# EAGLE design ioboard (EAGLE 9.6.2)
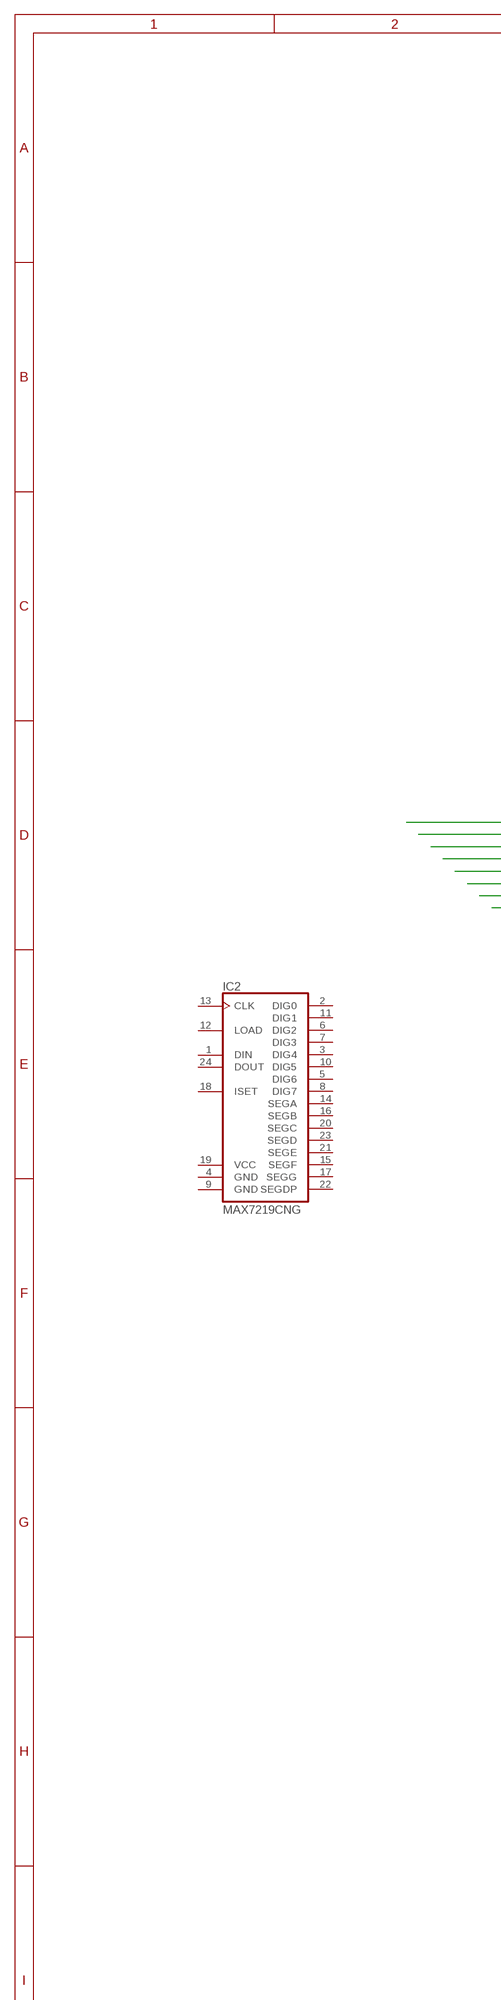
[diagram p0: schematic, sheet 1, part 1 of 2]
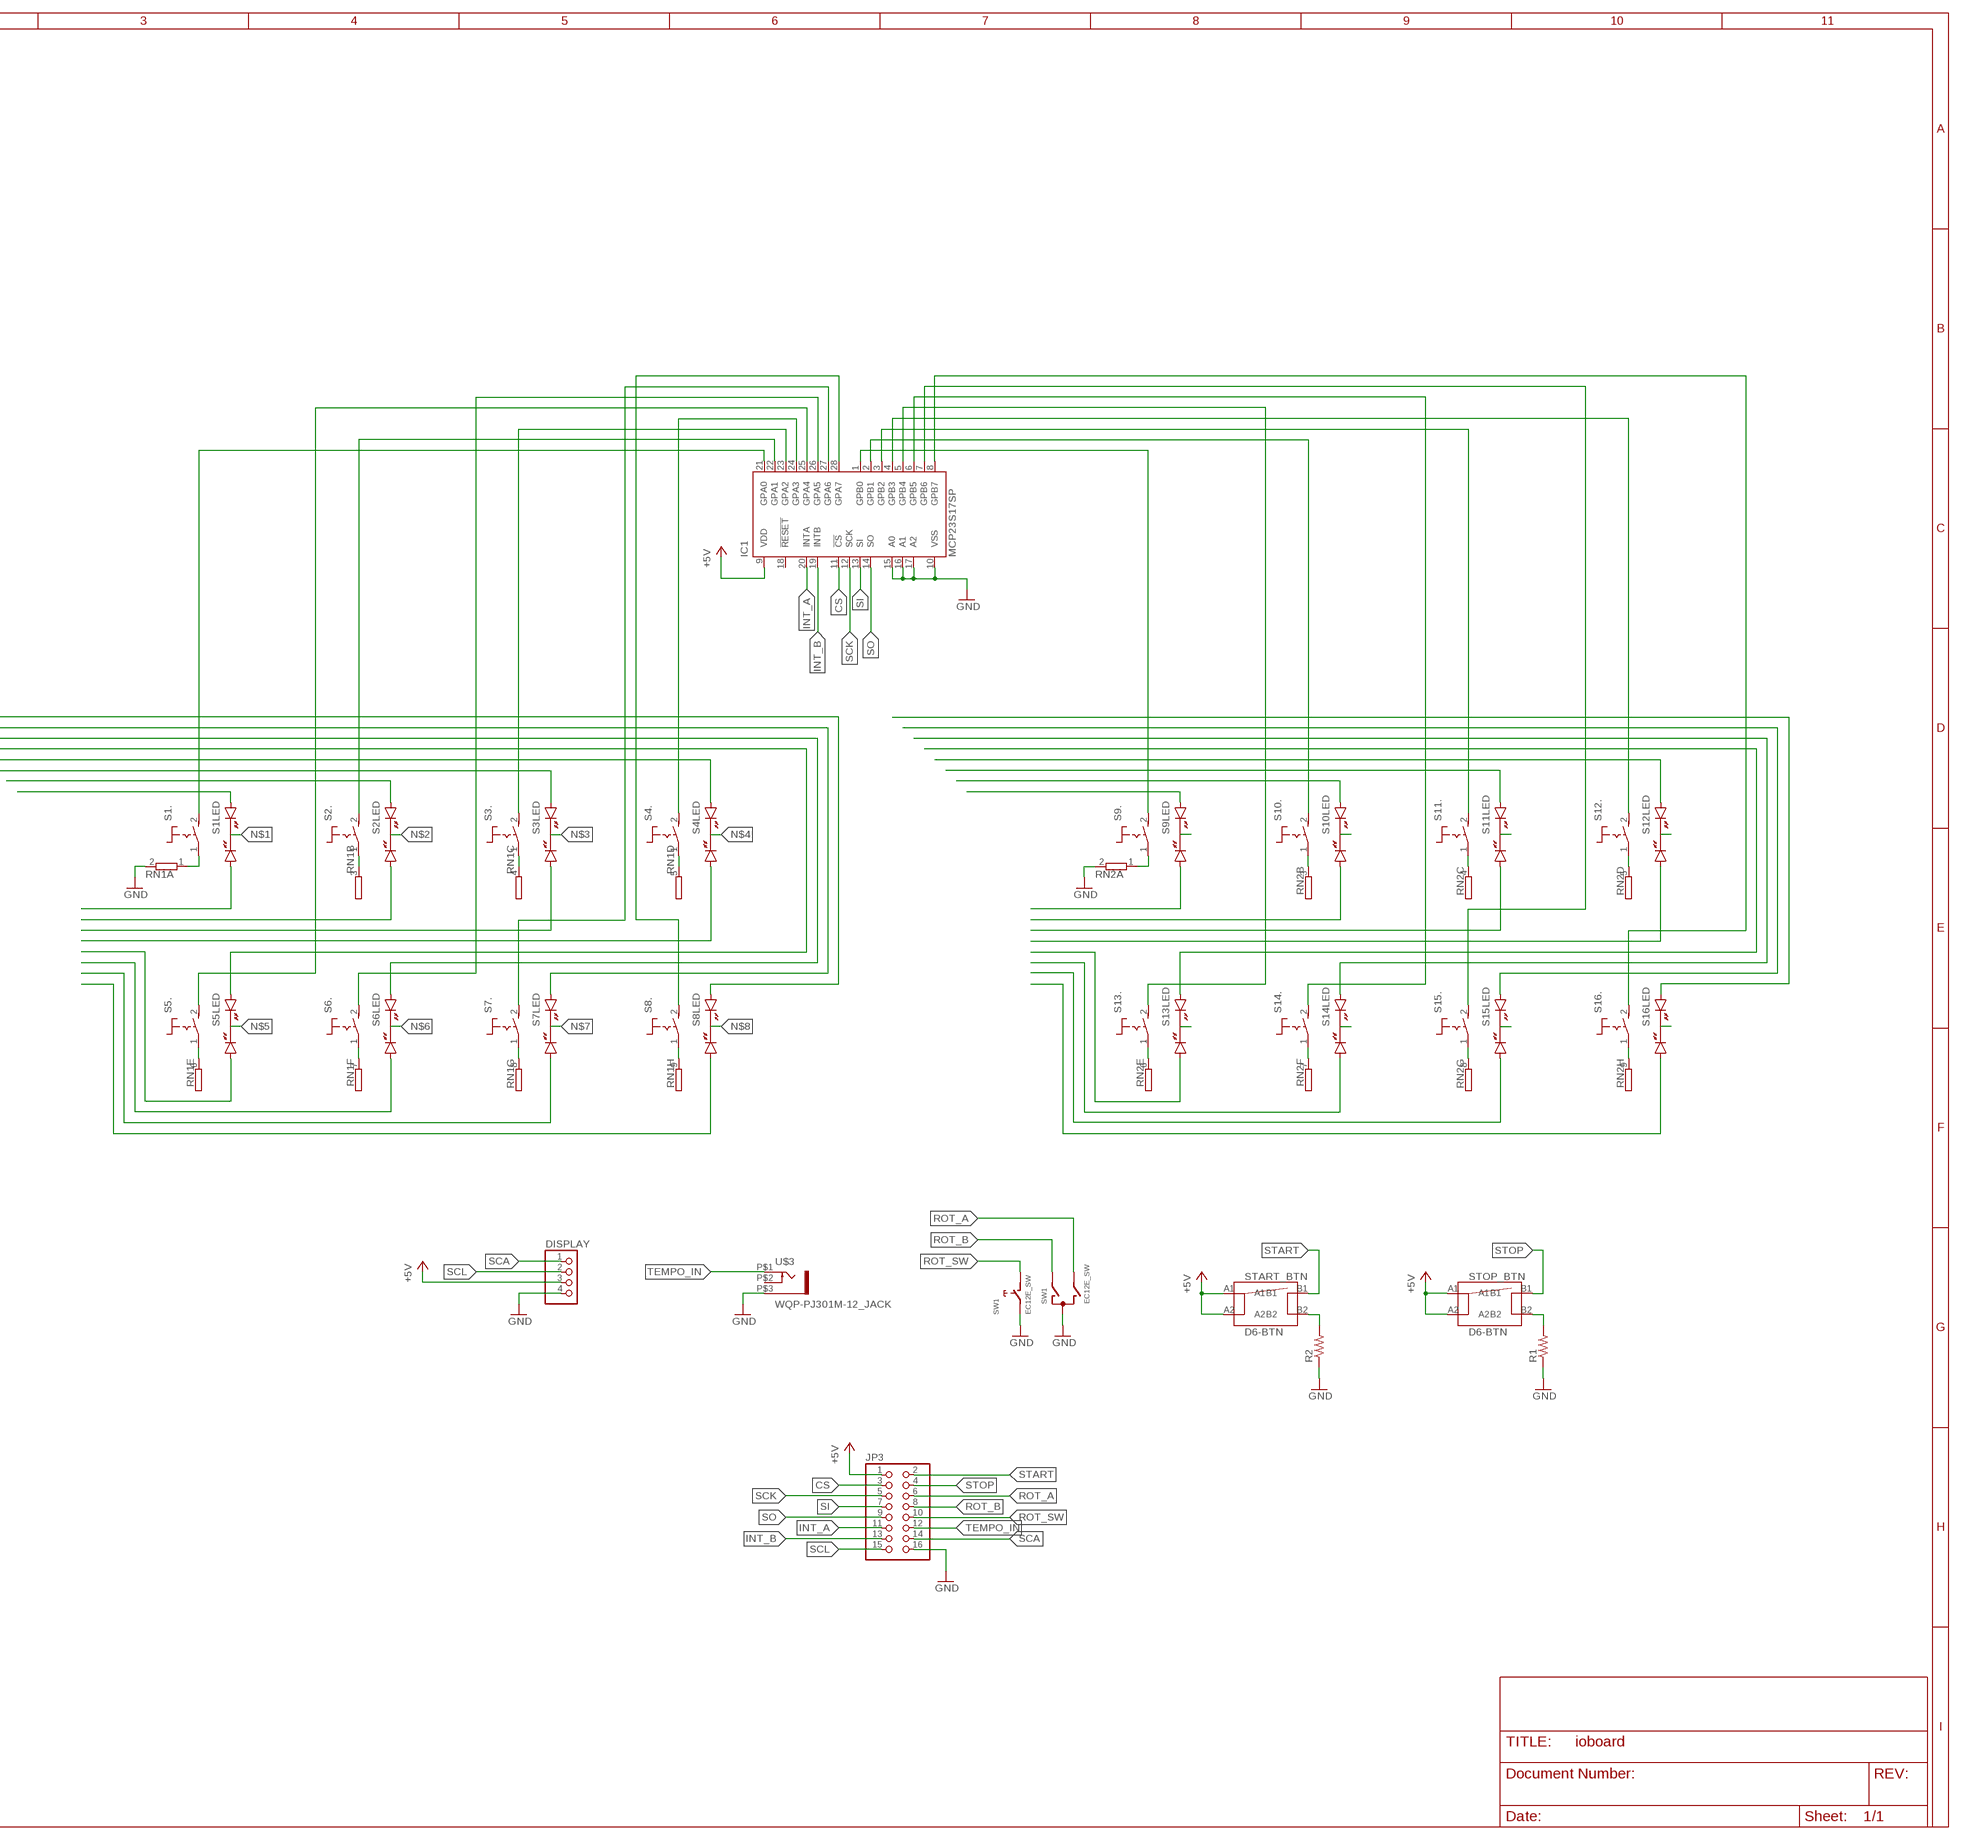
[diagram p1: schematic, sheet 1, part 2 of 2]

## Parts
DISPLAY  PINHD-1X4  [1X04]
IC1  MCP23S17SP  [DIL28-3]
IC2  MAX7219CNG  [DIL24-3]
JP3  PINHD-2X8  [2X08]
R1  R-US_0207/7  [0207/7]
R2  R-US_0207/7  [0207/7]
RN1  GE08R  [SIL9]
RN2  GE08R  [SIL9]
S1  MARQ6425-3MM-DUOLED  [MARQ6425-3MM-DUOLED]
S2  MARQ6425-3MM-DUOLED  [MARQ6425-3MM-DUOLED]
S3  MARQ6425-3MM-DUOLED  [MARQ6425-3MM-DUOLED]
S4  MARQ6425-3MM-DUOLED  [MARQ6425-3MM-DUOLED]
S5  MARQ6425-3MM-DUOLED  [MARQ6425-3MM-DUOLED]
S6  MARQ6425-3MM-DUOLED  [MARQ6425-3MM-DUOLED]
S7  MARQ6425-3MM-DUOLED  [MARQ6425-3MM-DUOLED]
S8  MARQ6425-3MM-DUOLED  [MARQ6425-3MM-DUOLED]
S9  MARQ6425-3MM-DUOLED  [MARQ6425-3MM-DUOLED]
S10  MARQ6425-3MM-DUOLED  [MARQ6425-3MM-DUOLED]
S11  MARQ6425-3MM-DUOLED  [MARQ6425-3MM-DUOLED]
S12  MARQ6425-3MM-DUOLED  [MARQ6425-3MM-DUOLED]
S13  MARQ6425-3MM-DUOLED  [MARQ6425-3MM-DUOLED]
S14  MARQ6425-3MM-DUOLED  [MARQ6425-3MM-DUOLED]
S15  MARQ6425-3MM-DUOLED  [MARQ6425-3MM-DUOLED]
S16  MARQ6425-3MM-DUOLED  [MARQ6425-3MM-DUOLED]
START_BTN  D6-BTN  [D6-BTN]
STOP_BTN  D6-BTN  [D6-BTN]
SW1  EC12E_SW  [ALPS_EC12E_SW]
U$3  WQP-PJ301M-12_JACK  [WQP-PJ301M-12_JACK]

## Nets
+5V: DISPLAY.3 IC1.9(VDD) JP3.1 START_BTN.A1 START_BTN.A2 STOP_BTN.A1 STOP_BTN.A2
CS: IC1.11(!CS) JP3.3
GND: DISPLAY.4 IC1.10(VSS) IC1.15(A0) IC1.16(A1) IC1.17(A2) JP3.16 R1.1 R2.1 RN1.2 RN2.2 SW1.C SW1.E U$3.P$3
INT_A: IC1.20(INTA) JP3.11
INT_B: IC1.19(INTB) JP3.13
N$1: S1.K(LED:K)
N$2: S2.K(LED:K)
N$3: S3.K(LED:K)
N$4: S4.K(LED:K)
N$5: S5.K(LED:K)
N$6: S6.K(LED:K)
N$7: S7.K(LED:K)
N$8: S8.K(LED:K)
N$9: S9.K(LED:K)
N$10: S10.K(LED:K)
N$11: S11.K(LED:K)
N$12: S12.K(LED:K)
N$13: S13.K(LED:K)
N$14: S14.K(LED:K)
N$15: S15.K(LED:K)
N$16: S16.K(LED:K)
N$17: S1.AR(LED:AR)
N$18: S2.AR(LED:AR)
N$19: S3.AR(LED:AR)
N$20: S4.AR(LED:AR)
N$21: S5.AR(LED:AR)
N$22: S6.AR(LED:AR)
N$23: S7.AR(LED:AR)
N$24: S8.AR(LED:AR)
N$25: S1.AG(LED:AG)
N$26: S2.AG(LED:AG)
N$27: S3.AG(LED:AG)
N$28: S4.AG(LED:AG)
N$29: S5.AG(LED:AG)
N$30: S6.AG(LED:AG)
N$31: S7.AG(LED:AG)
N$32: S8.AG(LED:AG)
N$33: S9.AR(LED:AR)
N$34: S10.AR(LED:AR)
N$35: S11.AR(LED:AR)
N$36: S12.AR(LED:AR)
N$37: S13.AR(LED:AR)
N$38: S14.AR(LED:AR)
N$39: S15.AR(LED:AR)
N$40: S16.AR(LED:AR)
N$41: S9.AG(LED:AG)
N$42: S10.AG(LED:AG)
N$43: S11.AG(LED:AG)
N$44: S12.AG(LED:AG)
N$45: S13.AG(LED:AG)
N$46: S14.AG(LED:AG)
N$47: S15.AG(LED:AG)
N$48: S16.AG(LED:AG)
N$49: RN1.9 S8.1(.:P)
N$50: RN1.8 S7.1(.:P)
N$51: RN1.7 S6.1(.:P)
N$52: RN1.6 S5.1(.:P)
N$53: RN1.5 S4.1(.:P)
N$54: RN1.4 S3.1(.:P)
N$55: RN1.3 S2.1(.:P)
N$56: RN1.1 S1.1(.:P)
N$57: RN2.3 S10.1(.:P)
N$58: RN2.4 S11.1(.:P)
N$59: RN2.5 S12.1(.:P)
N$60: RN2.6 S13.1(.:P)
N$61: RN2.7 S14.1(.:P)
N$62: RN2.8 S15.1(.:P)
N$63: RN2.9 S16.1(.:P)
N$64: RN2.1 S9.1(.:P)
N$65: IC1.21(GPA0) S1.2(.:S)
N$66: IC1.22(GPA1) S2.2(.:S)
N$67: IC1.23(GPA2) S3.2(.:S)
N$68: IC1.24(GPA3) S4.2(.:S)
N$69: IC1.25(GPA4) S5.2(.:S)
N$70: IC1.26(GPA5) S6.2(.:S)
N$71: IC1.27(GPA6) S7.2(.:S)
N$72: IC1.28(GPA7) S8.2(.:S)
N$73: IC1.1(GPB0) S9.2(.:S)
N$74: IC1.2(GPB1) S10.2(.:S)
N$75: IC1.3(GPB2) S11.2(.:S)
N$76: IC1.4(GPB3) S12.2(.:S)
N$77: IC1.5(GPB4) S13.2(.:S)
N$78: IC1.6(GPB5) S14.2(.:S)
N$79: IC1.7(GPB6) S15.2(.:S)
N$80: IC1.8(GPB7) S16.2(.:S)
N$93: R2.2 START_BTN.B2
N$94: R1.2 STOP_BTN.B2
ROT_A: JP3.6 SW1.B
ROT_B: JP3.8 SW1.A
ROT_SW: JP3.10 SW1.D
SCA: DISPLAY.1 JP3.14
SCK: IC1.12(SCK) JP3.5
SCL: DISPLAY.2 JP3.15
SI: IC1.13(SI) JP3.7
SO: IC1.14(SO) JP3.9
START: JP3.2 START_BTN.B1
STOP: JP3.4 STOP_BTN.B1
TEMPO_IN: JP3.12 U$3.P$1
Unconnected: IC1.18(!RESET) IC2.1(DIN) IC2.2(DIG0) IC2.3(DIG4) IC2.5(DIG6) IC2.6(DIG2) IC2.7(DIG3) IC2.8(DIG7) IC2.10(DIG5) IC2.11(DIG1) IC2.12(LOAD) IC2.13(CLK) IC2.14(SEGA) IC2.15(SEGF) IC2.16(SEGB) IC2.17(SEGG) IC2.18(ISET) IC2.20(SEGC) IC2.21(SEGE) IC2.22(SEGDP) IC2.23(SEGD) IC2.24(DOUT) SW1.GND1(G) SW1.GND2(G) U$3.P$2

## Power pins joined to a net without a drawn wire
GND: IC2.4(GND) IC2.9(GND)
VCC: IC2.19(VCC)

## Library data of the parts
DISPLAY = pinhead:PINHD-1X4: PIN HEADER
IC1 = microchip:MCP23S17: http://ww1.microchip.com/downloads/en/DeviceDoc/21952a.pdf Source: http://ww1.microchip.com/downloads/en/DeviceDoc/21952a.pdf; MF: MICROCHIP; MPN: MCP23S17-E/SP; OC_FARNELL: 1292238; OC_NEWARK: 31K2951
IC2 = maxim:MAX7219CNG: LED DISPLAY DRIVER; MF: MAXIM; MPN: MAX7219CNG; OC_FARNELL: 1523914; OC_NEWARK: 34C4018
JP3 = pinhead:PINHD-2X8: PIN HEADER
R1 R2 = rcl:R-US_: RESISTOR, American symbol; SPICEPREFIX: R
RN1 RN2 = resistor-sil:GE08R: SIL RESISTOR; OC_FARNELL: unknown; OC_NEWARK: unknown
S1-S16 = gerbster:MARQ6425-3MM-DUOLED: DIL SWITCH with LED, Marquardt
START_BTN STOP_BTN = gerbster:D6-BTN
SW1 = switch-alps:EC12E_SW: ALPS rotary Encoder EC12E series with switch; MPN: EC12E2424407; OC_FARNELL: 1520813; OC_NEWARK: 74M1068
U$3 = thonkiconn:WQP-PJ301M-12_JACK

## Board
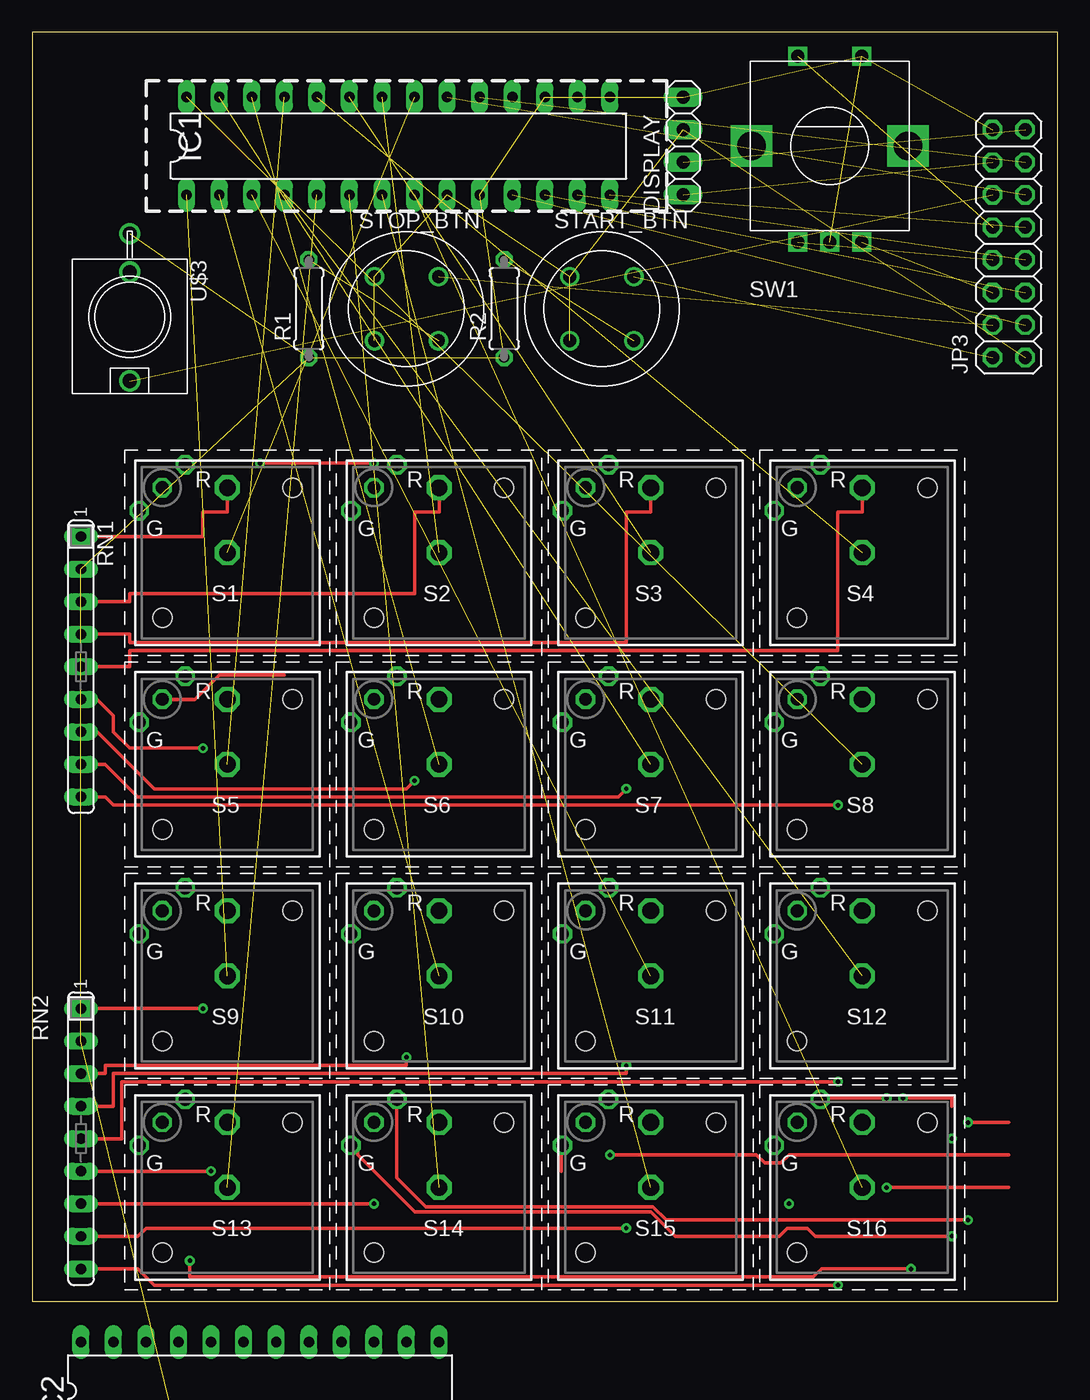
[diagram p2: board, top side]
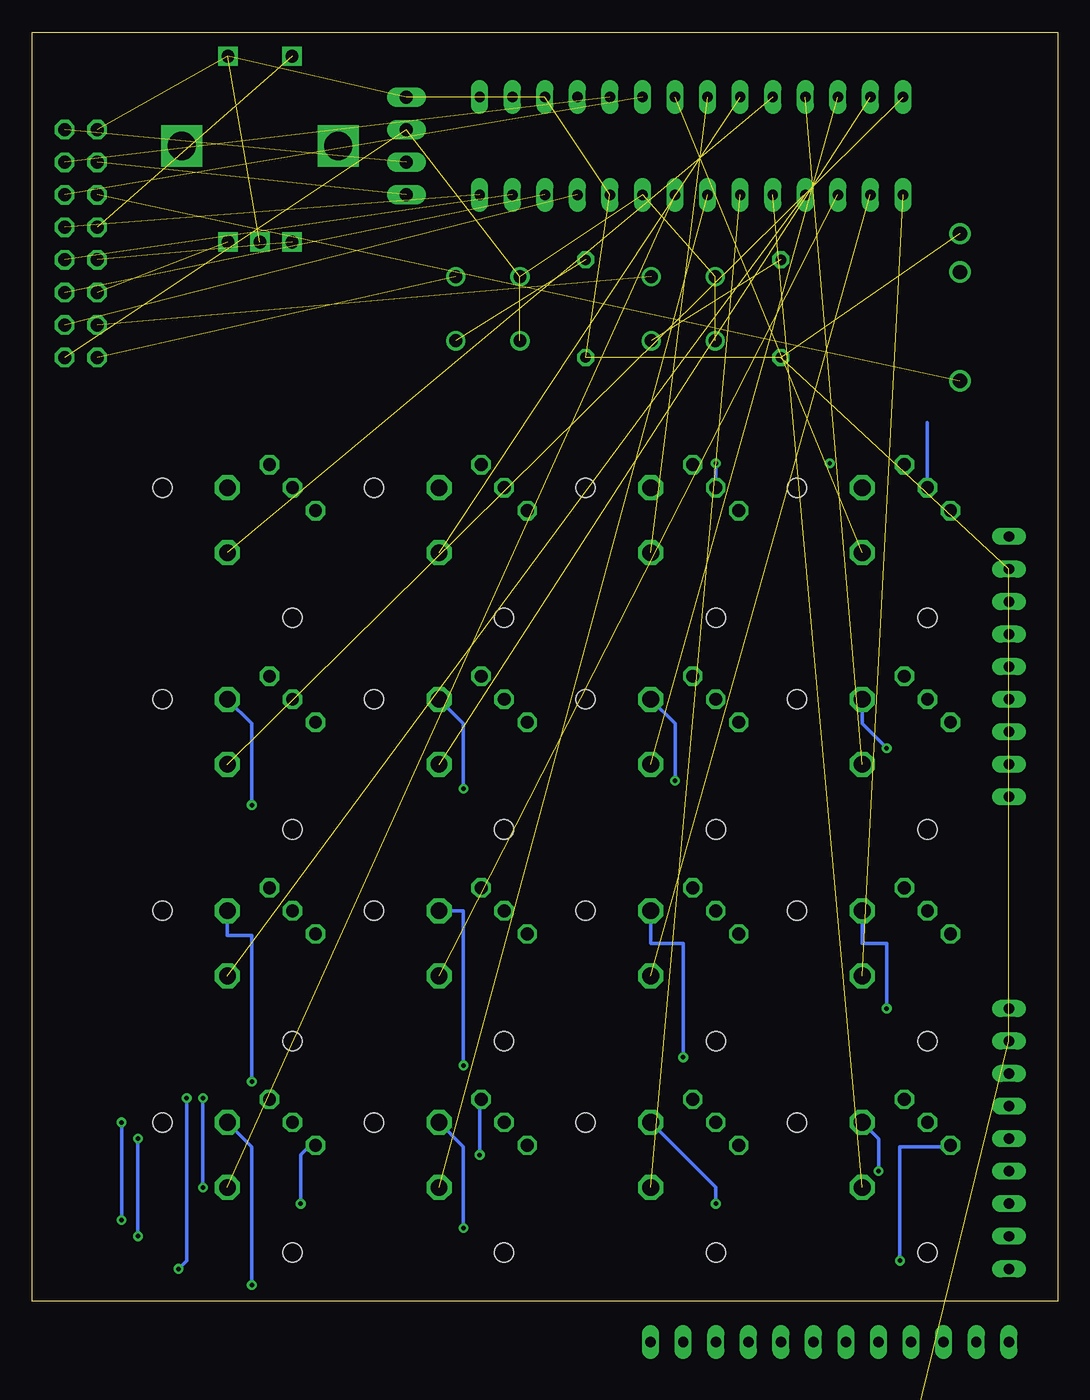
[diagram p3: board, bottom side, seen from below]

Size 80.01 x 99.06 mm. Coordinates in mm from the lower left corner, seen from the top.
Outline: 0,0 80.01,0 80.01,99.06 0,99.06 0,0
Copper layers (1*16): Top 0.035mm / dielectric 1.5mm / Bottom 0.035mm
Design rules "default": minimum track width 6mil, minimum drill 0.35mm, track to track 6mil, track to pad 6mil, pad to pad 6mil, via to via 6mil, smd to smd 6mil, copper to edge 40mil, drill to drill 6mil, minimum pad ring 10mil, minimum via ring 8mil, stop-mask expansion 4mil, vias tented up to drill 0mil, thermal gap 10mil

### Footprints (pad centres in the part's own frame; a part is rotated, then mirrored left to right if it is on the bottom)
1X04 = drill 1.016 long: 1 -3.81,0; 2 -1.27,0; 3 1.27,0; 4 3.81,0
DIL28-3 = drill 0.813 long: 1 -16.51,-3.81; 2 -13.97,-3.81; 3 -11.43,-3.81; 4 -8.89,-3.81; 5 -6.35,-3.81; 6 -3.81,-3.81; 7 -1.27,-3.81; 8 1.27,-3.81; 9 3.81,-3.81; 10 6.35,-3.81; 11 8.89,-3.81; 12 11.43,-3.81; 13 13.97,-3.81; 14 16.51,-3.81; 15 16.51,3.81; 16 13.97,3.81; 17 11.43,3.81; 18 8.89,3.81; 19 6.35,3.81; 20 3.81,3.81; 21 1.27,3.81; 22 -1.27,3.81; 23 -3.81,3.81; 24 -6.35,3.81; 25 -8.89,3.81; 26 -11.43,3.81; 27 -13.97,3.81; 28 -16.51,3.81
DIL24-3 = drill 0.813 long: 1 -13.97,-3.81; 2 -11.43,-3.81; 3 -8.89,-3.81; 4 -6.35,-3.81; 5 -3.81,-3.81; 6 -1.27,-3.81; 7 1.27,-3.81; 8 3.81,-3.81; 9 6.35,-3.81; 10 8.89,-3.81; 11 11.43,-3.81; 12 13.97,-3.81; 13 13.97,3.81; 14 11.43,3.81; 15 8.89,3.81; 16 6.35,3.81; 17 3.81,3.81; 18 1.27,3.81; 19 -1.27,3.81; 20 -3.81,3.81; 21 -6.35,3.81; 22 -8.89,3.81; 23 -11.43,3.81; 24 -13.97,3.81
2X08 = drill 1.016 octagon: 1 -8.89,-1.27; 2 -8.89,1.27; 3 -6.35,-1.27; 4 -6.35,1.27; 5 -3.81,-1.27; 6 -3.81,1.27; 7 -1.27,-1.27; 8 -1.27,1.27; 9 1.27,-1.27; 10 1.27,1.27; 11 3.81,-1.27; 12 3.81,1.27; 13 6.35,-1.27; 14 6.35,1.27; 15 8.89,-1.27; 16 8.89,1.27
0207/7 = drill 0.813 octagon: 1 -3.81,0; 2 3.81,0
SIL9 = drill 0.813 long: 1 -10.16,0; 2 -7.62,0; 3 -5.08,0; 4 -2.54,0; 5 0,0; 6 2.54,0; 7 5.08,0; 8 7.62,0; 9 10.16,0
MARQ6425-3MM-DUOLED = drill 1.3 octagon: 1 0,5.08; 2 0,0 | drill 1 octagon: AG -6.876,3.284; AR -3.284,6.876; K -5.08,5.08 | hole 1.5: 5.08,5.08; -5.08,-5.08
D6-BTN = drill 1: A1 -2.5,2.5; A2 -2.5,-2.5; B1 2.5,2.5; B2 2.5,-2.5
ALPS_EC12E_SW = drill 1 square: A -2.5,-7.5; B 2.5,-7.5; C 0,-7.5; D -2.5,7; E 2.5,7 | drill 2.2 square: GND1 -6.1,0; GND2 6.1,0
WQP-PJ301M-12_JACK = drill 1.1: P$1 0,5; P$2 0,-3.5; P$3 0,-6.5

### Placement (x,y rotation side)
DISPLAY  50.8,90.17 90 top
IC1  28.57,90.17 0 top
IC2  17.78,-6.99 0 top  (outside the outline)
JP3  76.2,82.55 90 top
R1  21.59,77.47 90 top
R2  36.83,77.47 90 top
RN1  3.81,49.53 270 top
RN2  3.81,12.7 270 top
S1  15.24,58.42 0 top
S2  31.75,58.42 0 top
S3  48.26,58.42 0 top
S4  64.77,58.42 0 top
S5  15.24,41.91 0 top
S6  31.75,41.91 0 top
S7  48.26,41.91 0 top
S8  64.77,41.91 0 top
S9  15.24,25.4 0 top
S10  31.75,25.4 0 top
S11  48.26,25.4 0 top
S12  64.77,25.4 0 top
S13  15.24,8.89 0 top
S14  31.75,8.89 0 top
S15  48.26,8.89 0 top
S16  64.77,8.89 0 top
START_BTN  44.45,77.47 0 top
STOP_BTN  29.21,77.47 0 top
SW1  62.23,90.17 0 top
U$3  7.62,76.83 180 top

### Tracks (layer width: path | path; a pad name or v marks a point on that pad's centre or on a via)
+5V  (6 unrouted)
CS  (1 unrouted)
GND  (14 unrouted)
INT_A  (1 unrouted)
INT_B  (1 unrouted)
N$1
  Bottom 0.254: S1.K 10.16,68.58
N$2  (via drill 0.35)
  Top 0.254: v17.78,65.41 v26.67,65.41
  Bottom 0.254: v26.67,65.41 S2.K
N$5
  Top 0.254: S5.K 12.7,46.99 14.61,48.9 19.68,48.9
N$38  (via drill 0.35)
  Top 0.254: 76.2,13.97 v73.03,13.97 | v73.03,6.35 49.47,6.35 48.43,7.39 30.71,7.39 28.47,9.63 S14.AR
  Bottom 0.254: v73.03,13.97 v73.03,6.35
N$39  (via drill 0.35)
  Top 0.254: 76.2,11.43 59.05,11.43 58.42,10.79 57.15,10.79 56.52,11.43 v45.09,11.43
  Bottom 0.254: v45.09,11.43 arc0 45.09,12.06 45.09,15.24 44.98,15.35 S15.AR
N$40  (via drill 0.35)
  Top 0.254: S16.AR 61.59,15.88 v66.67,15.88 | v66.67,8.89 76.2,8.89
  Bottom 0.254: v66.67,15.88 v66.67,8.89
N$45  (via drill 0.35)
  Top 0.254: v12.3,3.17 12.3,1.91 60.96,1.91 61.59,2.54 v68.58,2.54 | v67.94,15.88 71.75,15.88 71.75,15.24
  Bottom 0.254: S13.AG 8.36,12.06 12.3,12.06 v12.3,3.17 | v67.94,15.88 67.94,3.17 v68.58,2.54
N$46  (via drill 0.35)
  Top 0.254: v71.75,5.08 61.1,5.08 60.47,5.7 58.91,5.7 58.28,5.08 50.16,5.08 48.26,6.99 29.84,6.99 25.4,11.43 25.4,12.06 25.29,12.17 S14.AG
  Bottom 0.254: v71.75,12.7 v71.75,5.08
N$47
  Top 0.254: 41.27,10.16 41.27,12.06 S15.AG
N$48  (via drill 0.35)
  Bottom 0.254: v59.05,7.62 59.05,11.43 58.31,12.17 S16.AG
N$49  (via drill 0.35)
  Top 0.254: RN1.9 5.71,39.37 6.35,38.73 v62.87,38.73
  Bottom 0.254: v62.87,38.73 62.87,45.09 S8.1
N$50  (via drill 0.35)
  Top 0.254: RN1.8 5.71,41.91 8.26,39.37 45.72,39.37 v46.35,40.01
  Bottom 0.254: v46.35,40.01 46.35,45.09 S7.1
N$51  (via drill 0.35)
  Top 0.254: RN1.7 5.08,44.45 9.53,40.01 29.21,40.01 v29.84,40.64
  Bottom 0.254: v29.84,40.64 29.84,45.09 S6.1
N$52  (via drill 0.35)
  Top 0.254: v13.34,43.18 7.62,43.18 6.35,44.45 6.35,45.72 5.08,46.99 RN1.6
  Bottom 0.254: v13.34,43.18 15.24,45.09 S5.1
N$53
  Top 0.254: RN1.5 7.62,49.53 7.62,50.8 62.87,50.8 62.87,61.59 64.77,61.59 S4.1
N$54
  Top 0.254: RN1.4 7.62,52.07 7.62,51.44 46.35,51.44 46.35,61.59 48.26,61.59 S3.1
N$55
  Top 0.254: RN1.3 7.62,54.61 7.62,55.24 29.84,55.24 29.84,61.59 31.75,61.59 S2.1
N$56
  Top 0.254: S1.1 15.24,61.59 13.34,61.59 13.34,59.69 RN1.1
N$57  (via drill 0.35)
  Top 0.254: v29.21,19.05 29.21,18.41 5.71,18.41 5.71,17.78 RN2.3
  Bottom 0.254: v29.21,19.05 29.21,27.94 31.75,27.94 S10.1
N$58  (via drill 0.35)
  Top 0.254: RN2.4 6.35,15.24 6.35,17.78 46.35,17.78 v46.35,18.41
  Bottom 0.254: S11.1 46.35,30.48 v46.35,18.41
N$59  (via drill 0.35)
  Top 0.254: RN2.5 6.99,12.7 6.99,17.14 v62.87,17.14
  Bottom 0.254: v62.87,17.14 62.87,28.57 64.77,28.57 S12.1
N$60  (via drill 0.35)
  Top 0.254: RN2.6 v13.97,10.16
  Bottom 0.254: v13.97,10.16 13.97,12.7 S13.1
N$61  (via drill 0.35)
  Top 0.254: v26.67,7.62 RN2.7
  Bottom 0.254: v26.67,7.62 26.67,8.89 S14.1
N$62  (via drill 0.35)
  Top 0.254: RN2.8 8.26,5.08 8.89,5.71 v46.35,5.71
  Bottom 0.254: v46.35,5.71 46.35,12.06 S15.1
N$63  (via drill 0.35)
  Top 0.254: RN2.9 8.26,2.54 9.53,1.27 v62.87,1.27
  Bottom 0.254: v62.87,1.27 62.87,12.06 S16.1
N$64  (via drill 0.35)
  Top 0.254: RN2.1 v13.34,22.86
  Bottom 0.254: v13.34,22.86 13.34,27.94 15.24,27.94 S9.1
N$65  (1 unrouted)
N$66  (1 unrouted)
N$67  (1 unrouted)
N$68  (1 unrouted)
N$69  (1 unrouted)
N$70  (1 unrouted)
N$71  (1 unrouted)
N$72  (1 unrouted)
N$73  (1 unrouted)
N$74  (1 unrouted)
N$75  (1 unrouted)
N$76  (1 unrouted)
N$77  (1 unrouted)
N$78  (1 unrouted)
N$79  (1 unrouted)
N$80  (1 unrouted)
N$93  (1 unrouted)
N$94  (1 unrouted)
ROT_A  (1 unrouted)
ROT_B  (1 unrouted)
ROT_SW  (1 unrouted)
SCA  (1 unrouted)
SCK  (1 unrouted)
SCL  (1 unrouted)
SI  (1 unrouted)
SO  (1 unrouted)
START  (1 unrouted)
STOP  (1 unrouted)
TEMPO_IN  (1 unrouted)